# EAGLE design Fireplace Control (EAGLE 6.4)
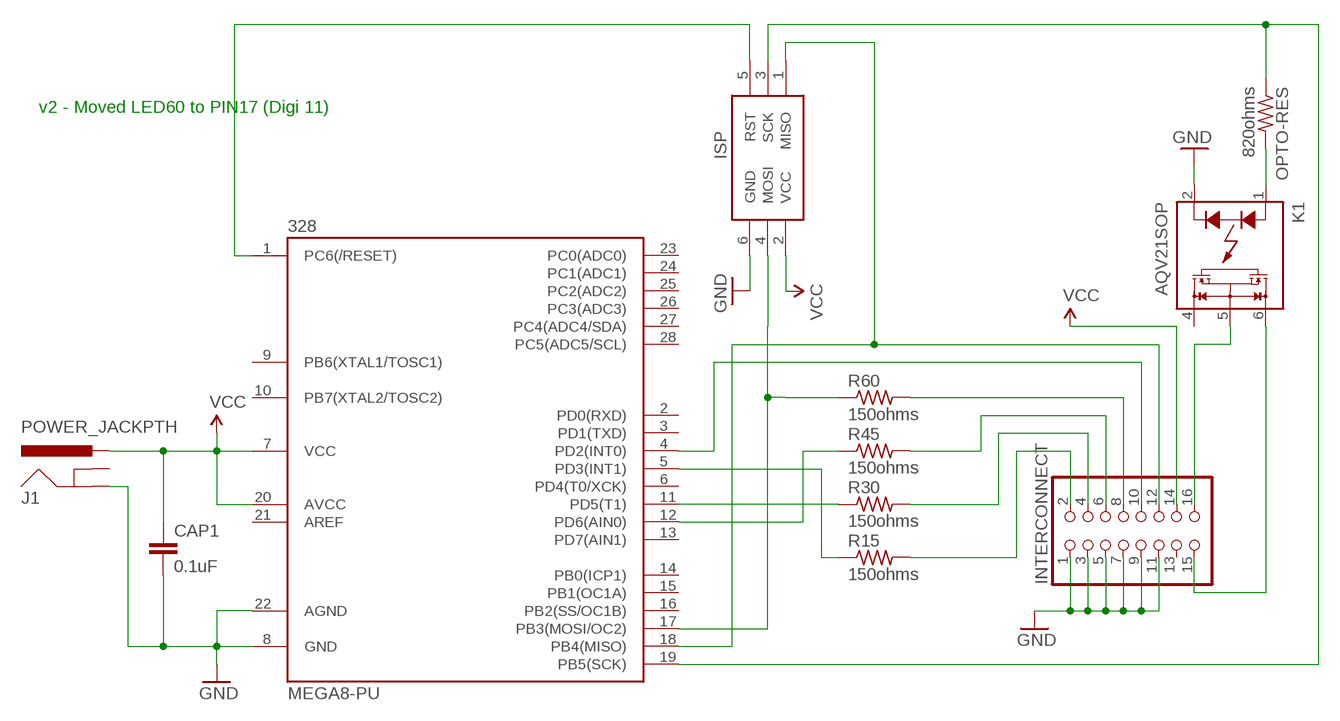
[diagram p0: schematic, sheet 1]

## Parts
328  MEGA8-PU  [DIL28-3]
CAP1  0.1uF  CAPKIT  [CAP-PTH-SMALL-KIT]
INTERCONNECT  PINHD-2X8  [2X08]
ISP  AVRISP-6  [AVRISP]
J1  POWER_JACKPTH  [POWER_JACK_PTH]
K1  AQV21SOP  [SOP06]
OPTO-RES  820ohms  R-US_0207/2V  [0207/2V]
R15  150ohms  R-US_0207/2V  [0207/2V]
R30  150ohms  R-US_0207/2V  [0207/2V]
R45  150ohms  R-US_0207/2V  [0207/2V]
R60  150ohms  R-US_0207/2V  [0207/2V]

## Nets
15+: INTERCONNECT.2 R15.2
30+: INTERCONNECT.4 R30.2
45+: INTERCONNECT.6 R45.2
60+: INTERCONNECT.8 R60.2
GND: 328.8(GND) 328.22(AGND) CAP1.2 INTERCONNECT.1 INTERCONNECT.3 INTERCONNECT.5 INTERCONNECT.7 INTERCONNECT.9 INTERCONNECT.11 ISP.6(GND) J1.GND K1.2(K)
N$1: 328.11(PD5(T1)) R30.1
N$6: INTERCONNECT.15 K1.6(D1)
N$7: 328.12(PD6(AIN0)) R45.1
N$8: 328.17(PB3(MOSI/OC2)) ISP.4(MOSI) R60.1
N$9: K1.1(A) OPTO-RES.2
N$11: 328.19(PB5(SCK)) ISP.3(SCK) OPTO-RES.1
N$12: 328.18(PB4(MISO)) INTERCONNECT.12 ISP.1(MISO)
N$13: INTERCONNECT.16 K1.5(S)
N$16: 328.5(PD3(INT1)) R15.1
N$18: 328.1(PC6(/RESET)) ISP.5(RST)
N$19: 328.4(PD2(INT0)) INTERCONNECT.10
VCC: 328.7(VCC) 328.20(AVCC) CAP1.1 INTERCONNECT.14 ISP.2(VCC) J1.PWR
Unconnected: 328.2(PD0(RXD)) 328.3(PD1(TXD)) 328.6(PD4(T0/XCK)) 328.9(PB6(XTAL1/TOSC1)) 328.10(PB7(XTAL2/TOSC2)) 328.13(PD7(AIN1)) 328.14(PB0(ICP1)) 328.15(PB1(OC1A)) 328.16(PB2(SS/OC1B)) 328.21(AREF) 328.23(PC0(ADC0)) 328.24(PC1(ADC1)) 328.25(PC2(ADC2)) 328.26(PC3(ADC3)) 328.27(PC4(ADC4/SDA)) 328.28(PC5(ADC5/SCL)) INTERCONNECT.13 J1.GNDBREAK K1.4(D2)

## Notes on the sheet
- v2 - Moved LED60 to PIN17 (Digi 11)

## Library data of the parts
328 = avr-4:MEGA8-PU
CAP1 = SparkFun-Capacitors:CAP: Capacitor Standard 0603 ceramic capacitor, and 0.1" leaded capacitor.
INTERCONNECT = pinhead:PINHD-2X8: PIN HEADER
ISP = adafruit:AVRISP: AVR ISP HEADER Standard 6 pin header for AVR programming
J1 = SparkFun-Connectors:POWER_JACK: Power Jack This is the standard 5.5mm barrel jack for power. The PTH is the most common, proven, reliable, footprint. The Slot footprint only works if the mill layer is transmitted to the PCB fab house so be warned. Spark Fun Electronics SKU : PRT-00119 SMT: CONN-08106 Mating wall wart : TOL-00298 (and others)
K1 = relay:AQV*: PhotoMOS Relay NAiS Source: Data sheet <http://www.panasonic-electric-works.com/catalogues/downloads/photomos/ds_x615_en_aqv10_20.pdf>; OC_FARNELL: unknown; OC_NEWARK: unknown
OPTO-RES R15 R30 R45 R60 = resistor:R-US_: RESISTOR, American symbol

## Board
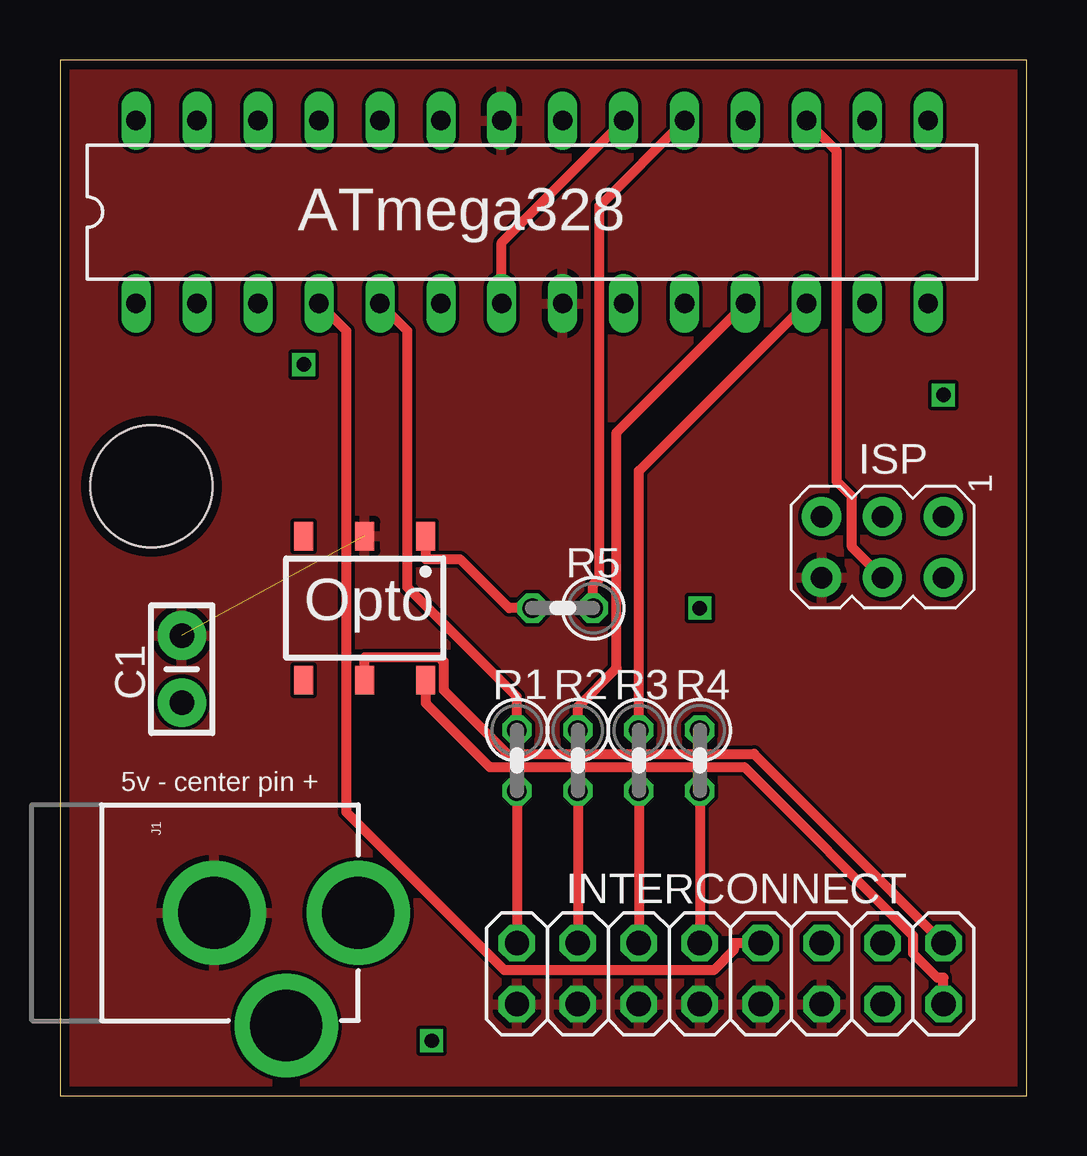
[diagram p1: board, top side]
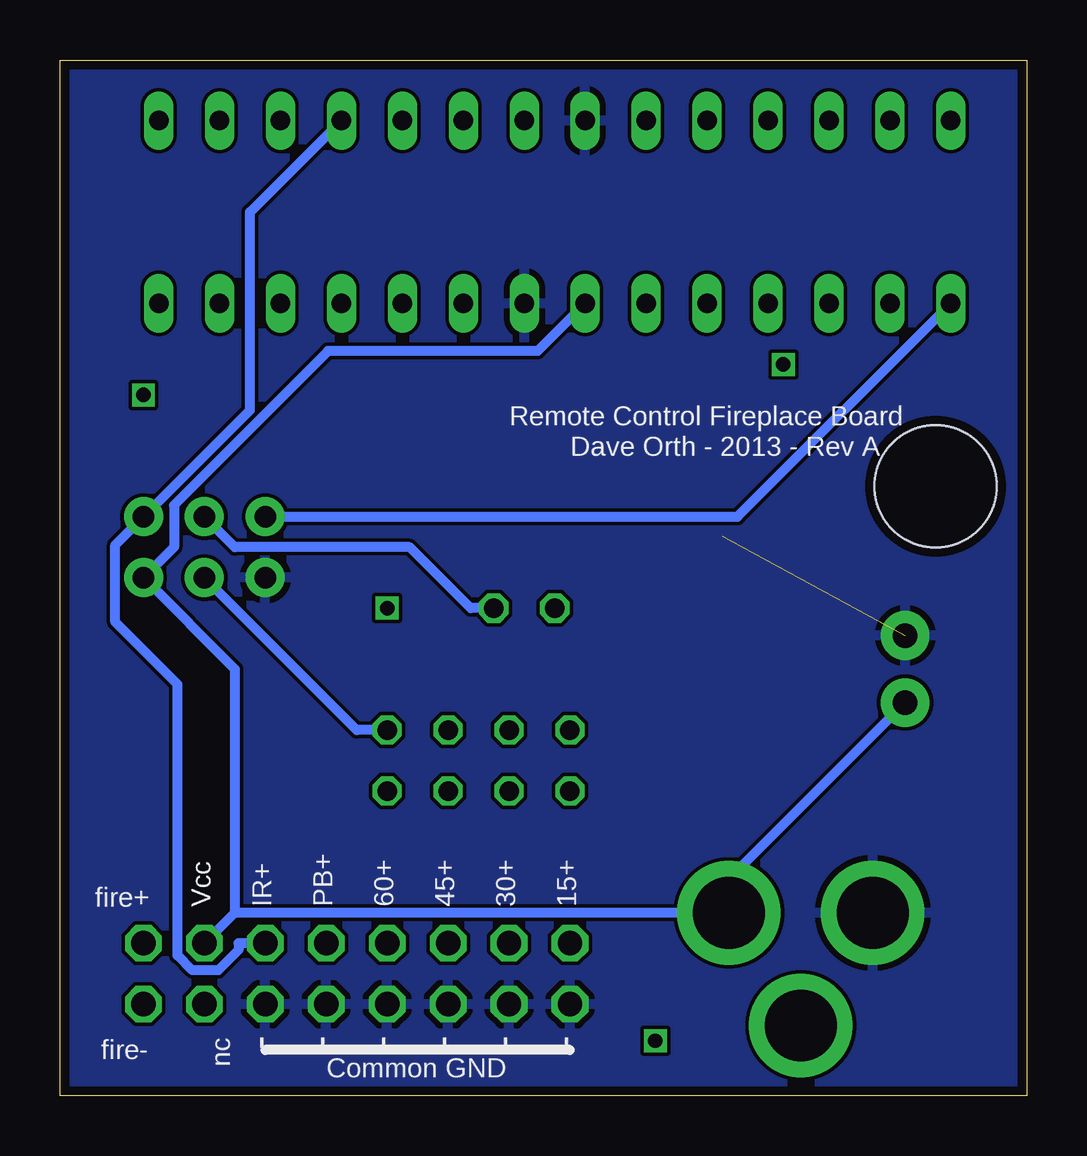
[diagram p2: board, bottom side, seen from below]

Size 40.31 x 43.17 mm. Coordinates in mm from the lower left corner, seen from the top.
Outline: 0,0 40.31,0 40.31,43.17 0,43.17 0,0
Copper layers (1*16): Top 0.0356mm / dielectric 1.5011mm / Bottom 0.0356mm
Design rules "OSHPark": minimum track width 6mil, minimum drill 13mil, track to track 6mil, track to pad 6mil, pad to pad 6mil, via to via 6mil, smd to smd 6mil, copper to edge 15mil, drill to drill 6mil, minimum pad ring 7mil, minimum via ring 7mil, stop-mask expansion 4mil, vias tented up to drill 0mil, thermal gap 10mil
Holes 5.08 mm at 3.81,25.4

### Footprints (pad centres in the part's own frame; a part is rotated, then mirrored left to right if it is on the bottom)
DIL28-3 = drill 0.813 long: 1 -16.51,-3.81; 2 -13.97,-3.81; 3 -11.43,-3.81; 4 -8.89,-3.81; 5 -6.35,-3.81; 6 -3.81,-3.81; 7 -1.27,-3.81; 8 1.27,-3.81; 9 3.81,-3.81; 10 6.35,-3.81; 11 8.89,-3.81; 12 11.43,-3.81; 13 13.97,-3.81; 14 16.51,-3.81; 15 16.51,3.81; 16 13.97,3.81; 17 11.43,3.81; 18 8.89,3.81; 19 6.35,3.81; 20 3.81,3.81; 21 1.27,3.81; 22 -1.27,3.81; 23 -3.81,3.81; 24 -6.35,3.81; 25 -8.89,3.81; 26 -11.43,3.81; 27 -13.97,3.81; 28 -16.51,3.81
CAP-PTH-SMALL-KIT = drill 1.016 pad 2.032: 1 -1.397,0; 2 1.397,0
2X08 = drill 1.016 octagon: 1 -8.89,-1.27; 2 -8.89,1.27; 3 -6.35,-1.27; 4 -6.35,1.27; 5 -3.81,-1.27; 6 -3.81,1.27; 7 -1.27,-1.27; 8 -1.27,1.27; 9 1.27,-1.27; 10 1.27,1.27; 11 3.81,-1.27; 12 3.81,1.27; 13 6.35,-1.27; 14 6.35,1.27; 15 8.89,-1.27; 16 8.89,1.27
AVRISP = drill 0.9 pad 1.626: 1 -1.27,2.54; 2 1.27,2.54; 3 -1.27,0; 4 1.27,0; 5 -1.27,-2.54; 6 1.27,-2.54
POWER_JACK_PTH = drill 2.997 pad 4.318: GND 0,7.7; GNDBREAK 4.7,10.7; PWR 0,13.7
SOP06 = smd 0.8 x 1.2: 1 -2.54,-3; 2 0,-3; 3 2.54,-3; 4 2.54,3; 5 0,3; 6 -2.54,3
0207/2V = drill 0.813 octagon: 1 -1.27,0; 2 1.27,0

### Placement (x,y rotation side)
328  19.69,36.83 0 top
CAP1  5.08,17.78 90 top
INTERCONNECT  27.94,5.08 0 top
ISP  34.29,22.86 270 top
J1  -1.27,7.62 270 top
K1  12.7,20.32 180 top
OPTO-RES  20.96,20.32 180 top
R15  19.05,13.97 270 top
R30  21.59,13.97 270 top
R45  24.13,13.97 270 top
R60  26.67,13.97 270 top

### Tracks (layer width: path | path; a pad name or v marks a point on that pad's centre or on a via)
15+
  Top 0.406: R15.2 INTERCONNECT.2
30+
  Top 0.406: R30.2 INTERCONNECT.4
45+
  Top 0.406: R45.2 INTERCONNECT.6
60+
  Top 0.406: R60.2 INTERCONNECT.8
GND  (1 unrouted)
  pour Top: -3.81,48.26 50.8,48.26 50.8,-1.27 -3.81,-1.27
  pour Bottom: -3.81,48.26 -3.81,-1.27 50.8,-1.27 50.8,48.26
N$1
  Top 0.406: R30.1 21.59,16.2 23.2,17.82 23.2,27.65 328.11
N$2  (via drill 0.6)
  other vias: 36.83,29.21
N$3  (via drill 0.6)
  other vias: 15.49,2.29
N$4  (via drill 0.6)
  other vias: 26.67,20.32
N$5  (via drill 0.6)
  other vias: 10.16,30.48
N$6
  Top 0.406: INTERCONNECT.15 36.83,4.93 36.56,4.93 35.56,5.92 35.56,6.66 28.53,13.69 17.91,13.69 15.24,16.36 K1.6
N$7
  Top 0.406: R45.1 24.13,26.04 328.12
N$8
  Top 0.406: ISP.4 33.02,22.86 33.02,24.97 32.38,25.6 32.38,39.37 328.17
  Bottom 0.406: R60.1 27.94,15.24 ISP.4
N$9
  Top 0.406: OPTO-RES.2 18.72,20.32 16.68,22.36 15.24,22.36 K1.1
N$11
  Top 0.406: 328.19 22.48,37.08 22.48,21.54 22.23,21.29 OPTO-RES.1
  Bottom 0.406: OPTO-RES.1 23.19,20.32 25.73,22.86 33.02,22.86 ISP.3
N$12
  Bottom 0.406: INTERCONNECT.12 32.87,6.35 32.87,6.07 33.71,5.23 34.8,5.23 35.41,5.84 35.41,17.14 38,19.73 38,22.96 ISP.1 32.38,28.57 32.38,36.83 328.18
N$13
  Top 0.406: K1.5 12.7,18.28 15.83,18.28 16,18.11 16,16.91 18.65,14.25 28.93,14.25 INTERCONNECT.16
N$16
  Top 0.406: R15.1 19.05,16.62 14.48,21.18 14.48,31.87 328.5
N$18
  Bottom 0.406: ISP.5 12.07,24.13 328.1
N$19
  Top 0.406: INTERCONNECT.10 28.09,6.35 28.09,6.07 27.25,5.23 18.53,5.23 11.94,11.81 11.94,31.87 328.4
VCC
  Top 0.406: 328.7 18.41,35.56 328.20
  Bottom 0.406: CAP1.1 12.43,9.03 J1.PWR 33.02,7.62 | 33.02,7.62 INTERCONNECT.14 | 33.02,7.62 33.02,17.78 ISP.2 35.56,22.86 35.56,24.61 29.13,31.04 20.4,31.04 328.7

### Text on the board
_tsilk: ATmega328 | R5 | Opto | C1 | R1 | R2 | R3 | R4 | 5v - center pin +
_bsilk: Remote Control Fireplace Board | Dave Orth - 2013 - Rev A | 15+ | 30+ | 45+ | 60+ | PB+ | IR+ | Vcc | fire+ | - | - | - | - | - | - | nc | fire- | Common GND